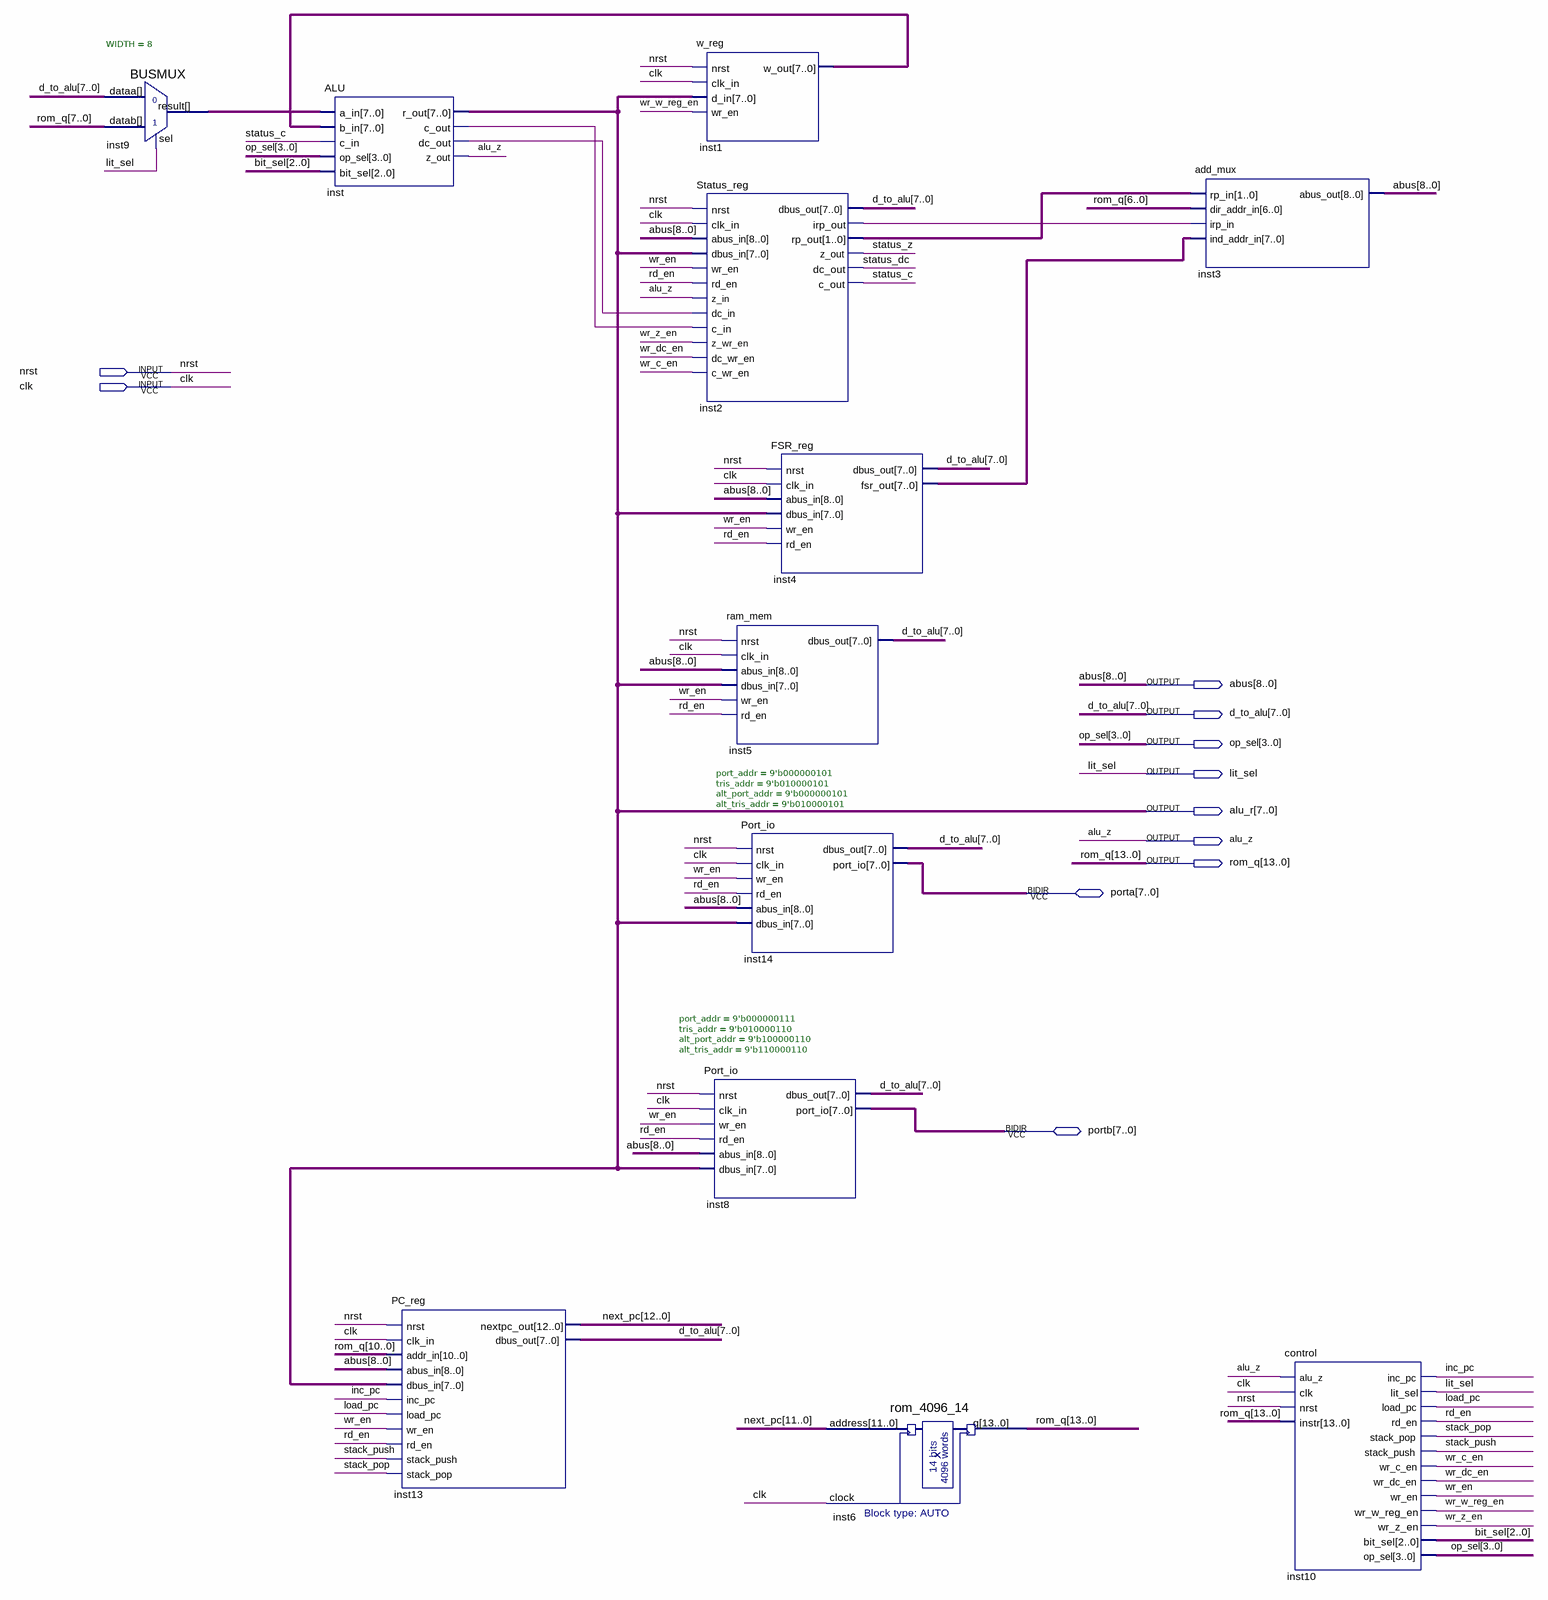
[diagram p0: schematic sheet]
// Quartus schematic ProcessadorSR.bdf as structural Verilog: 12 symbols, 11 pins
module ProcessadorSR (
  input  nrst,
  input  clk,
  inout  [7:0] porta,
  inout  [7:0] portb,
  output [8:0] abus,
  output [7:0] d_to_alu,
  output [3:0] op_sel,
  output lit_sel,
  output [7:0] alu_r,
  output alu_z,
  output [13:0] rom_q
);

  wire inc_pc, inst2_irp_out, inst_c_out, inst_dc_out, load_pc, rd_en, stack_pop, stack_push, status_c,
       status_dc, status_z, wr_c_en, wr_dc_en, wr_en, wr_w_reg_en, wr_z_en;
  wire [1:0] inst2_rp_out;
  wire [2:0] bit_sel;
  wire [7:0] inst1_w_out, inst4_fsr_out, inst9_result;
  wire [12:0] next_pc;

  BUSMUX #(.WIDTH(8)) inst9 (.datab(rom_q[7:0]), .sel(lit_sel), .dataa(d_to_alu), .result(inst9_result));
  ALU inst (
    .a_in(inst9_result), .b_in(inst1_w_out), .c_in(status_c), .op_sel(op_sel), .bit_sel(bit_sel),
    .r_out(alu_r), .c_out(inst_c_out), .dc_out(inst_dc_out), .z_out(alu_z));
  PC_reg inst13 (
    .nrst(nrst), .clk_in(clk), .addr_in(rom_q[10:0]), .abus_in(abus), .dbus_in(alu_r), .inc_pc(inc_pc),
    .load_pc(load_pc), .wr_en(wr_en), .rd_en(rd_en), .stack_push(stack_push), .stack_pop(stack_pop),
    .nextpc_out(next_pc), .dbus_out(d_to_alu));
  w_reg inst1 (.nrst(nrst), .clk_in(clk), .d_in(alu_r), .wr_en(wr_w_reg_en), .w_out(inst1_w_out));
  Status_reg inst2 (
    .nrst(nrst), .clk_in(clk), .abus_in(abus), .dbus_in(alu_r), .wr_en(wr_en), .rd_en(rd_en), .z_in(alu_z),
    .dc_in(inst_dc_out), .c_in(inst_c_out), .z_wr_en(wr_z_en), .dc_wr_en(wr_dc_en), .c_wr_en(wr_c_en),
    .dbus_out(d_to_alu), .irp_out(inst2_irp_out), .rp_out(inst2_rp_out), .z_out(status_z),
    .dc_out(status_dc), .c_out(status_c));
  ram_mem inst5 (
    .nrst(nrst), .clk_in(clk), .abus_in(abus), .dbus_in(alu_r), .wr_en(wr_en), .rd_en(rd_en),
    .dbus_out(d_to_alu));
  Port_io #(.port_addr(9'b000000101), .tris_addr(9'b010000101), .alt_port_addr(9'b000000101), .alt_tris_addr(9'b010000101)) inst14 (
    .nrst(nrst), .clk_in(clk), .wr_en(wr_en), .rd_en(rd_en), .abus_in(abus), .dbus_in(alu_r),
    .dbus_out(d_to_alu), .port_io(porta));
  Port_io #(.port_addr(9'b000000111), .tris_addr(9'b010000110), .alt_port_addr(9'b100000110), .alt_tris_addr(9'b110000110)) inst8 (
    .nrst(nrst), .clk_in(clk), .wr_en(wr_en), .rd_en(rd_en), .abus_in(abus), .dbus_in(alu_r),
    .dbus_out(d_to_alu), .port_io(portb));
  FSR_reg inst4 (
    .nrst(nrst), .clk_in(clk), .abus_in(abus), .dbus_in(alu_r), .wr_en(wr_en), .rd_en(rd_en),
    .dbus_out(d_to_alu), .fsr_out(inst4_fsr_out));
  rom_4096_14 inst6 (.address(next_pc[11:0]), .clock(clk), .q(rom_q));
  add_mux inst3 (
    .rp_in(inst2_rp_out), .dir_addr_in(rom_q[6:0]), .irp_in(inst2_irp_out), .ind_addr_in(inst4_fsr_out),
    .abus_out(abus));
  control inst10 (
    .alu_z(alu_z), .clk(clk), .nrst(nrst), .instr(rom_q), .inc_pc(inc_pc), .lit_sel(lit_sel),
    .load_pc(load_pc), .rd_en(rd_en), .stack_pop(stack_pop), .stack_push(stack_push), .wr_c_en(wr_c_en),
    .wr_dc_en(wr_dc_en), .wr_en(wr_en), .wr_w_reg_en(wr_w_reg_en), .wr_z_en(wr_z_en), .bit_sel(bit_sel),
    .op_sel(op_sel));
endmodule
